# EAGLE design mega8 (EAGLE 6.6.0)
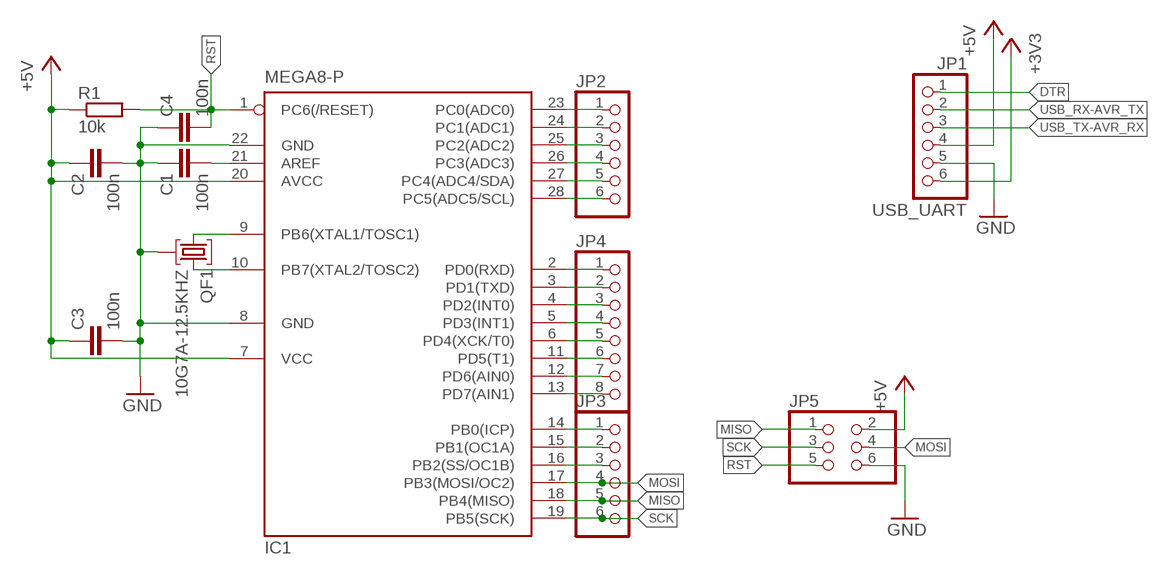
[diagram p0: schematic, sheet 1]

## Parts
C1  100n  C-EUC0603  [C0603]
C2  100n  C-EUC0603  [C0603]
C3  100n  C-EUC0603  [C0603]
C4  100n  C-EUC0603  [C0603]
IC1  MEGA8-P  [DIL28-3]
JP1  USB_UART  PINHD-1X6  [1X06]
JP2  PINHD-1X6  [1X06]
JP3  PINHD-1X6  [1X06]
JP4  PINHD-1X8  [1X08]
JP5  PINHD-2X3  [2X03]
QF1  10G7A-12.5KHZ  [HC49U]
R1  10k  R-EU_R0603  [R0603]

## Nets
+3V3: JP1.6
+5V: C2.1 C3.1 IC1.7(VCC) IC1.20(AVCC) JP1.4 JP5.2 R1.1
DTR: JP1.1
GND: C1.1 C2.2 C3.2 C4.1 IC1.8(GND) IC1.22(GND) JP1.5 JP5.6 QF1.2
MISO: IC1.18(PB4(MISO)) JP3.5 JP5.1
MOSI: IC1.17(PB3(MOSI/OC2)) JP3.4 JP5.4
N$1: IC1.9(PB6(XTAL1/TOSC1)) QF1.1
N$2: IC1.10(PB7(XTAL2/TOSC2)) QF1.3
N$3: IC1.23(PC0(ADC0)) JP2.1
N$4: C1.2 IC1.21(AREF)
N$6: IC1.24(PC1(ADC1)) JP2.2
N$7: IC1.25(PC2(ADC2)) JP2.3
N$8: IC1.26(PC3(ADC3)) JP2.4
N$9: IC1.27(PC4(ADC4/SDA)) JP2.5
N$10: IC1.28(PC5(ADC5/SCL)) JP2.6
N$11: IC1.14(PB0(ICP)) JP3.1
N$12: IC1.15(PB1(OC1A)) JP3.2
N$13: IC1.16(PB2(SS/OC1B)) JP3.3
N$17: IC1.2(PD0(RXD)) JP4.1
N$18: IC1.3(PD1(TXD)) JP4.2
N$19: IC1.4(PD2(INT0)) JP4.3
N$20: IC1.5(PD3(INT1)) JP4.4
N$21: IC1.6(PD4(XCK/T0)) JP4.5
N$22: IC1.11(PD5(T1)) JP4.6
N$23: IC1.12(PD6(AIN0)) JP4.7
N$24: IC1.13(PD7(AIN1)) JP4.8
RST: C4.2 IC1.1(PC6(/RESET)) JP5.5 R1.2
SCK: IC1.19(PB5(SCK)) JP3.6 JP5.3
USB_RX-AVR_TX: JP1.2
USB_TX-AVR_RX: JP1.3

## Library data of the parts
C1-C4 = rcl:C-EU: CAPACITOR, European symbol
IC1 = atmel:MEGA8-P: MICROCONTROLLER 8 Kbytes FLASH, 1 kbytes SRAM, 512 bytes EEPROM, USART, 4-channel 10 bit ADC, 2-channel 8 bit ADC Pin compatible with Atmega48, ATMega88, ATMega168 Source: avr.lbr; OC_FARNELL: unknown; OC_NEWARK: unknown
JP1-JP3 = pinhead:PINHD-1X6: PIN HEADER
JP4 = pinhead:PINHD-1X8: PIN HEADER
JP5 = pinhead:PINHD-2X3: PIN HEADER
QF1 = crystal:10G: Monolithic Crystal Filters Source: www.golledge.com; OC_FARNELL: unknown; OC_NEWARK: unknown
R1 = rcl:R-EU_: RESISTOR, European symbol

## Board
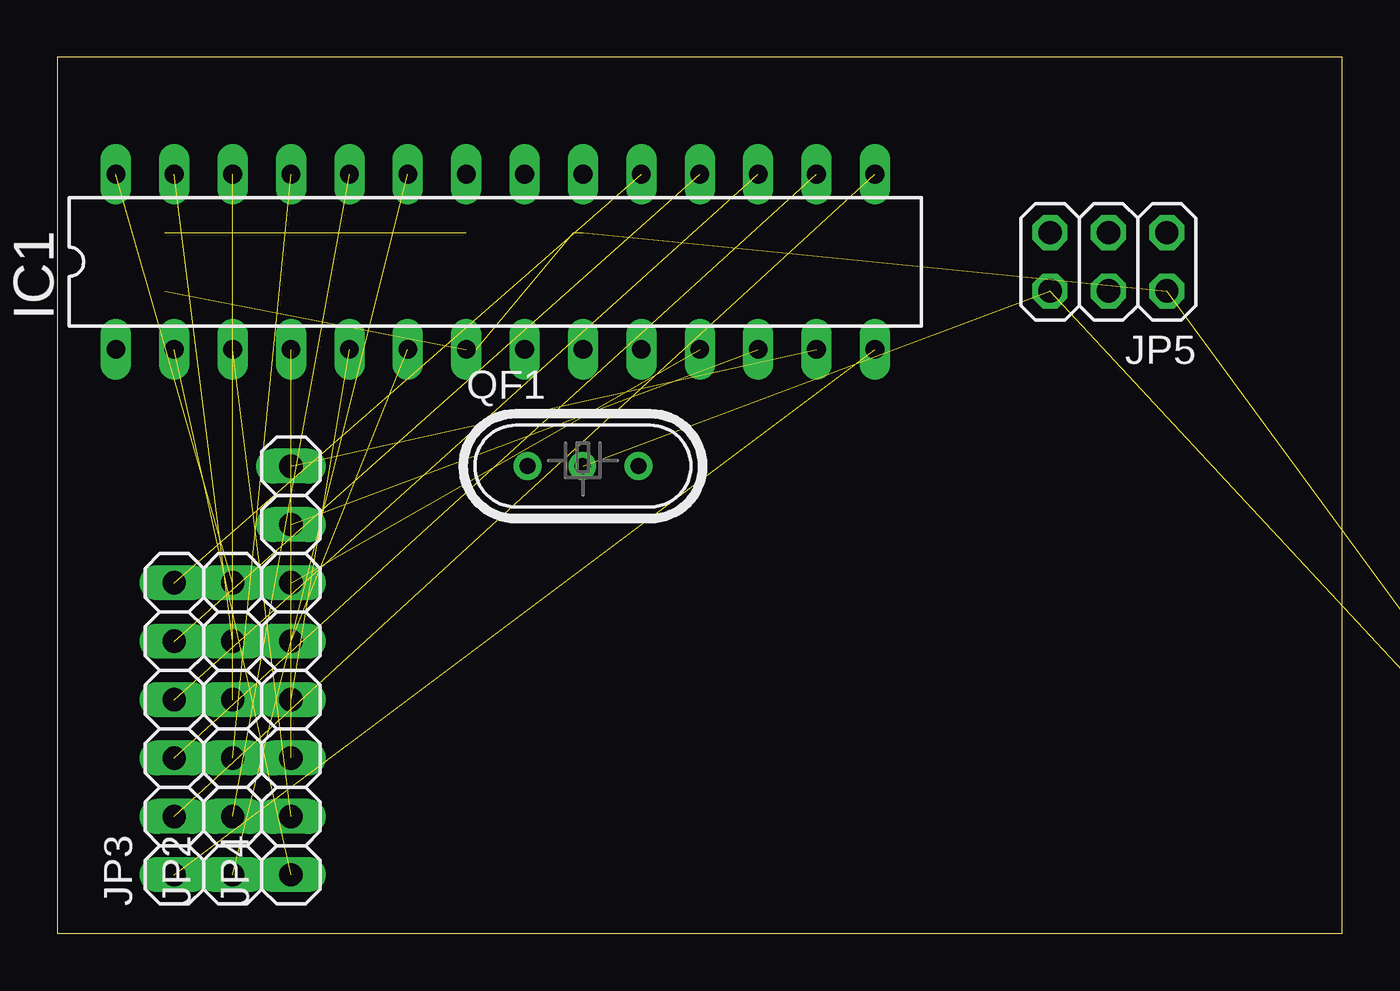
[diagram p1: board, top side]
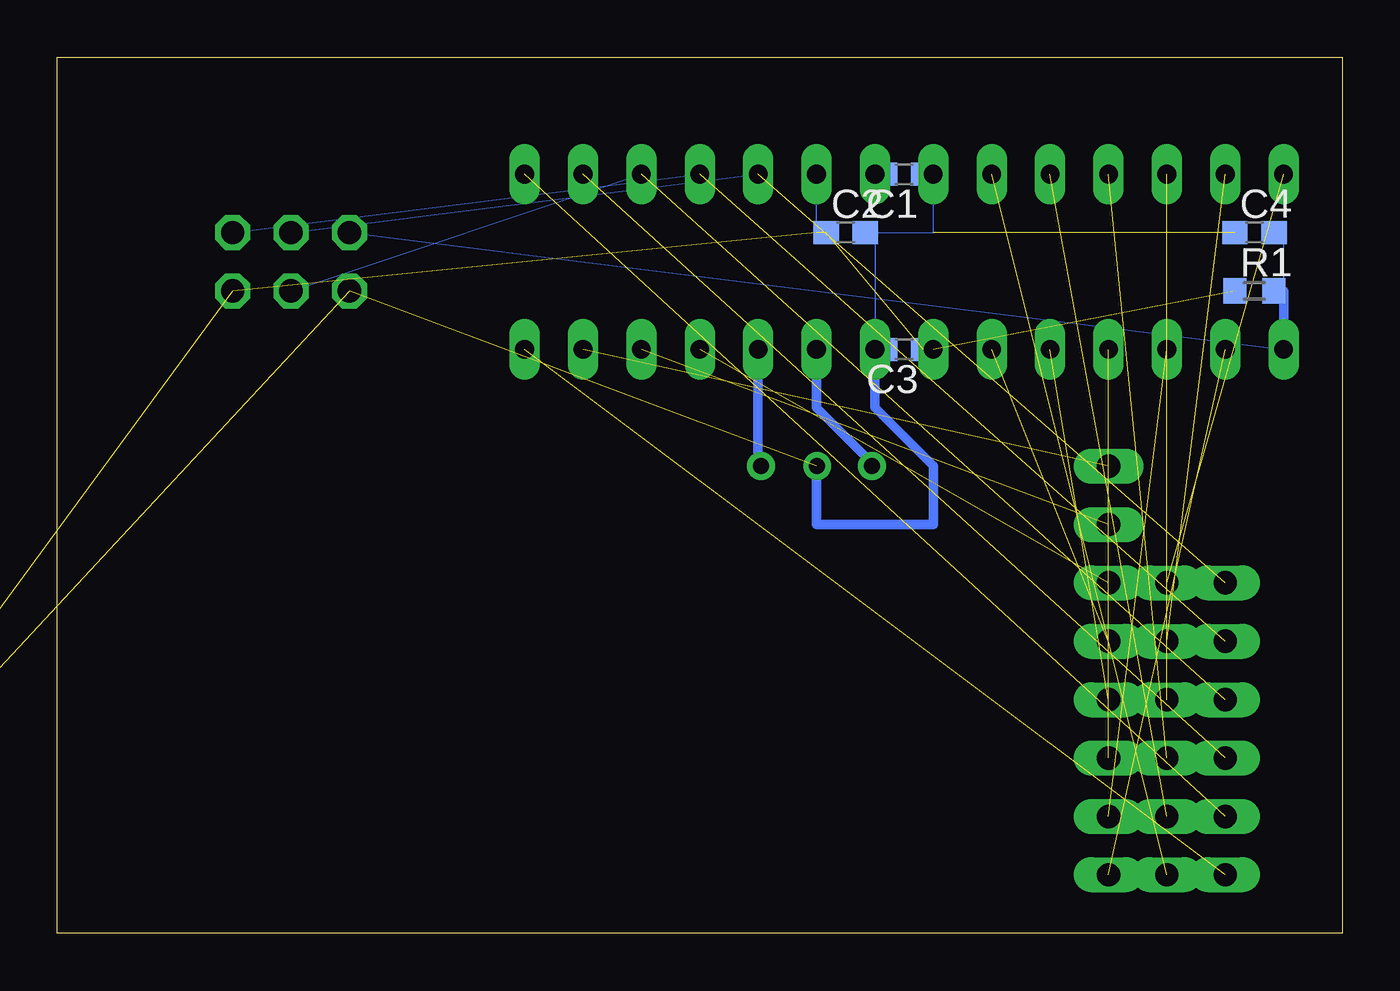
[diagram p2: board, bottom side, seen from below]

Size 55.88 x 38.1 mm. Coordinates in mm from the lower left corner, seen from the top.
Outline: 0,0 55.88,0 55.88,38.1 0,38.1 0,0
Copper layers (1*16): Top 0.035mm / dielectric 1.5mm / Bottom 0.035mm
Design rules "default": minimum track width 10mil, minimum drill 24mil, track to track 8mil, track to pad 8mil, pad to pad 8mil, via to via 8mil, smd to smd 8mil, copper to edge 40mil, drill to drill 8mil, minimum pad ring 10mil, minimum via ring 8mil, stop-mask expansion 4mil, vias tented up to drill 0mil, thermal gap 10mil

### Footprints (pad centres in the part's own frame; a part is rotated, then mirrored left to right if it is on the bottom)
C0603 = smd 1.1 x 1: 1 -0.85,0; 2 0.85,0
DIL28-3 = drill 0.813 long: 1 -16.51,-3.81; 2 -13.97,-3.81; 3 -11.43,-3.81; 4 -8.89,-3.81; 5 -6.35,-3.81; 6 -3.81,-3.81; 7 -1.27,-3.81; 8 1.27,-3.81; 9 3.81,-3.81; 10 6.35,-3.81; 11 8.89,-3.81; 12 11.43,-3.81; 13 13.97,-3.81; 14 16.51,-3.81; 15 16.51,3.81; 16 13.97,3.81; 17 11.43,3.81; 18 8.89,3.81; 19 6.35,3.81; 20 3.81,3.81; 21 1.27,3.81; 22 -1.27,3.81; 23 -3.81,3.81; 24 -6.35,3.81; 25 -8.89,3.81; 26 -11.43,3.81; 27 -13.97,3.81; 28 -16.51,3.81
1X06 = drill 1.016 long: 1 -6.35,0; 2 -3.81,0; 3 -1.27,0; 4 1.27,0; 5 3.81,0; 6 6.35,0
1X08 = drill 1.016 long: 1 -8.89,0; 2 -6.35,0; 3 -3.81,0; 4 -1.27,0; 5 1.27,0; 6 3.81,0; 7 6.35,0; 8 8.89,0
2X03 = drill 1.016 octagon: 1 -2.54,-1.27; 2 -2.54,1.27; 3 0,-1.27; 4 0,1.27; 5 2.54,-1.27; 6 2.54,1.27
HC49U = drill 0.7 pad 1.2: 1 -2.413,0; 2 -0.027,0; 3 2.413,0
R0603 = smd 1 x 1.1: 1 -0.85,0; 2 0.85,0

### Placement (x,y rotation side)
C1  19.05,33.02 180 bottom
C2  21.59,30.48 0 bottom
C3  19.05,25.4 180 bottom
C4  3.81,30.48 0 bottom
IC1  19.05,29.21 0 top
JP1  76.2,-11.43 90 top  (outside the outline)
JP2  7.62,8.89 90 top
JP3  5.08,8.89 90 top
JP4  10.16,11.43 90 top
JP5  45.72,29.21 180 top
QF1  22.86,20.32 0 top
R1  3.81,27.94 0 bottom

### Tracks (layer width: path | path; a pad name or v marks a point on that pad's centre or on a via)
+5V  (via drill 0.8)  (5 unrouted)
  Bottom 0: 22.86,30.48 IC1.20 | C3.1 IC1.7
  other vias: 17.78,25.4
GND  (3 unrouted)
  Bottom 0: C1.1 IC1.22 17.78,30.48 20.32,30.48 | C2.2 20.32,30.48 | 20.32,30.48 IC1.8
  Bottom 0.406: QF1.2 22.86,20.32 22.86,17.78 17.78,17.78 17.78,20.32 20.32,22.86 IC1.8 C3.2
MISO  (1 unrouted)
  Bottom 0: JP5.1 IC1.18
MOSI  (1 unrouted)
  Bottom 0: JP5.4 IC1.17
N$1
  Bottom 0.406: QF1.1 20.32,20.32 22.86,22.86 IC1.9
N$2
  Bottom 0.406: QF1.3 25.4,20.32 IC1.10
N$3  (1 unrouted)
N$4
  Bottom 0: C1.2 IC1.21
N$6  (1 unrouted)
N$7  (1 unrouted)
N$8  (1 unrouted)
N$9  (1 unrouted)
N$10  (1 unrouted)
N$11  (1 unrouted)
N$12  (1 unrouted)
N$13  (1 unrouted)
N$17  (1 unrouted)
N$18  (1 unrouted)
N$19  (1 unrouted)
N$20  (1 unrouted)
N$21  (1 unrouted)
N$22  (1 unrouted)
N$23  (1 unrouted)
N$24  (1 unrouted)
RST
  Bottom 0: JP5.5 IC1.1 | 2.54,27.94 2.54,30.48 C4.2
  Bottom 0.406: IC1.1 2.54,27.94 R1.2
SCK  (1 unrouted)
  Bottom 0: JP5.3 IC1.19